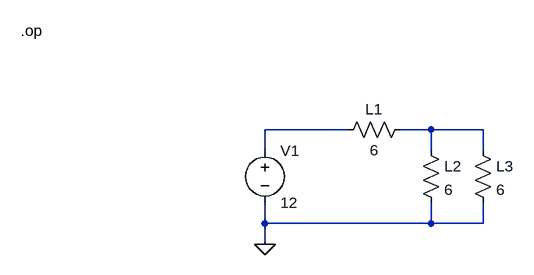
[diagram p0: schematic circuit.asc]
circuit.asc, the LTspice schematic file:
Version 4.1
SHEET 1 880 680
WIRE 112 96 -16 96
WIRE 240 96 192 96
WIRE 320 96 240 96
WIRE -16 128 -16 96
WIRE 240 128 240 96
WIRE 320 128 320 96
WIRE -16 240 -16 208
WIRE 240 240 240 208
WIRE 240 240 -16 240
WIRE 320 240 320 208
WIRE 320 240 240 240
WIRE -16 272 -16 240
FLAG -16 272 0
DATAFLAG -16 96 ""
DATAFLAG 240 96 ""
DATAFLAG 240 240 ""
DATAFLAG 320 240 ""
DATAFLAG 320 96 ""
DATAFLAG 64 96 "round(I(V1)*100)/100"
DATAFLAG 176 176 "round(I(L2)*100)/100"
DATAFLAG 416 176 "round(I(L3)*100)/100"
SYMBOL voltage -16 112 R0
WINDOW 123 0 0 Left 0
WINDOW 39 0 0 Left 0
SYMATTR InstName V1
SYMATTR Value 12
SYMBOL res 208 80 R90
WINDOW 0 0 56 VBottom 2
WINDOW 3 32 56 VTop 2
SYMATTR InstName L1
SYMATTR Value 6
SYMBOL res 224 112 R0
SYMATTR InstName L2
SYMATTR Value 6
SYMBOL res 304 112 R0
SYMATTR InstName L3
SYMATTR Value 6
TEXT -392 -56 Left 2 !.op

The netlist it stands for:
* circuit.asc
V1 N001 0 12
R§L1 N002 N001 6
R§L2 N002 0 6
R§L3 N002 0 6
.op
.backanno
.end